# EAGLE schematic MM2_plates (EAGLE 7.4.0)
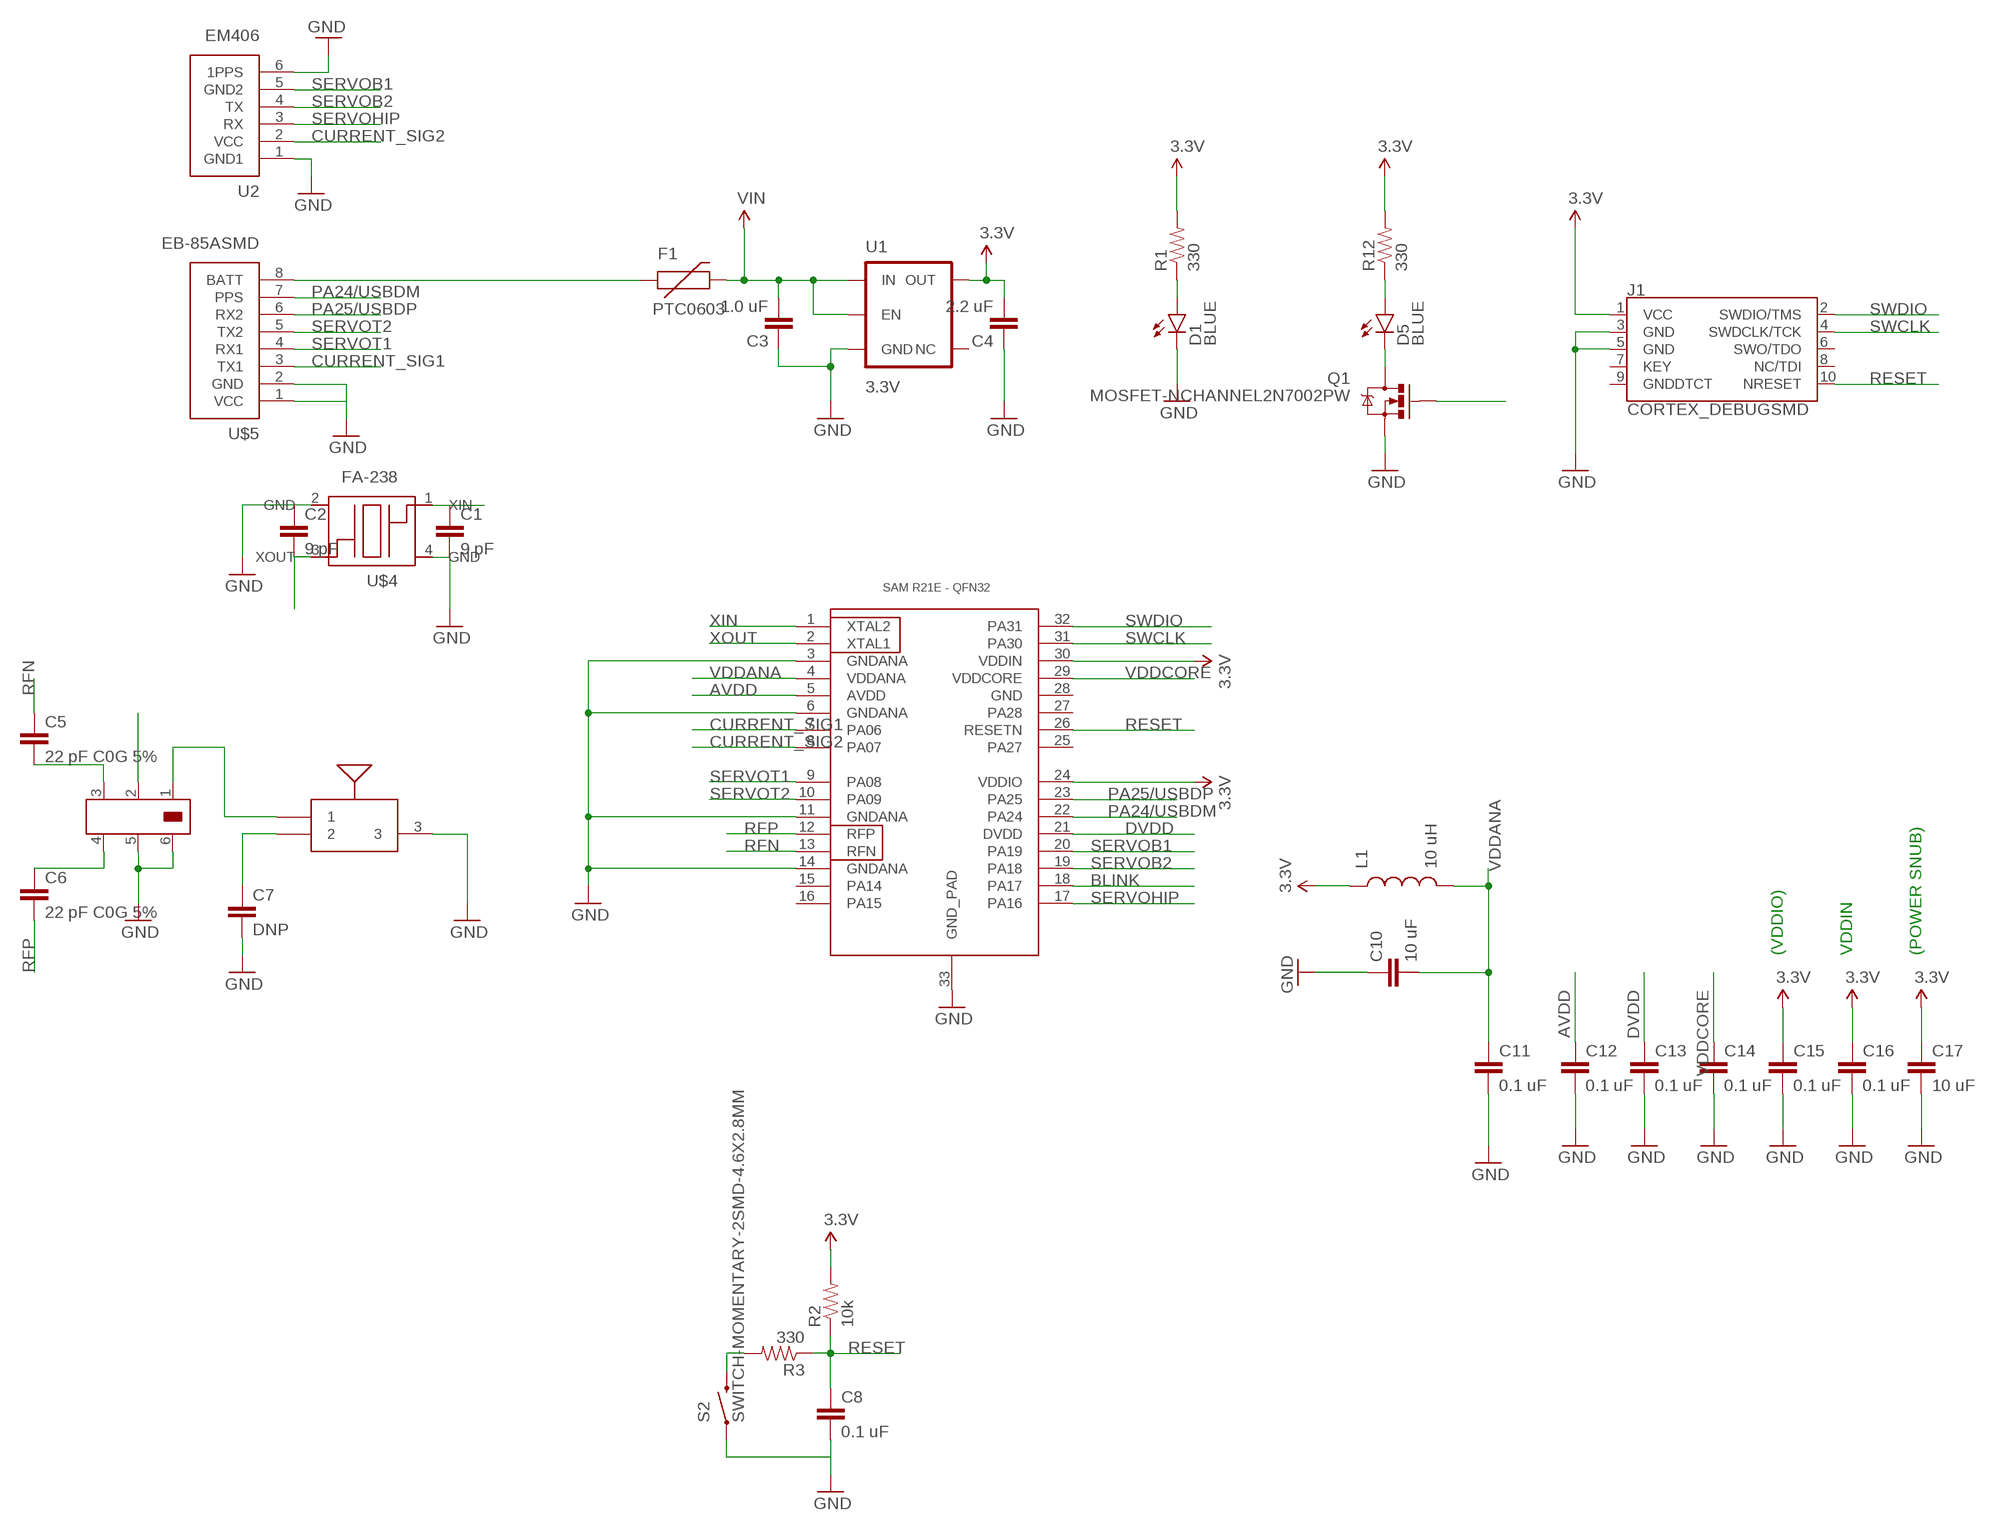
[diagram p0: schematic, sheet 1, part 1 of 2]
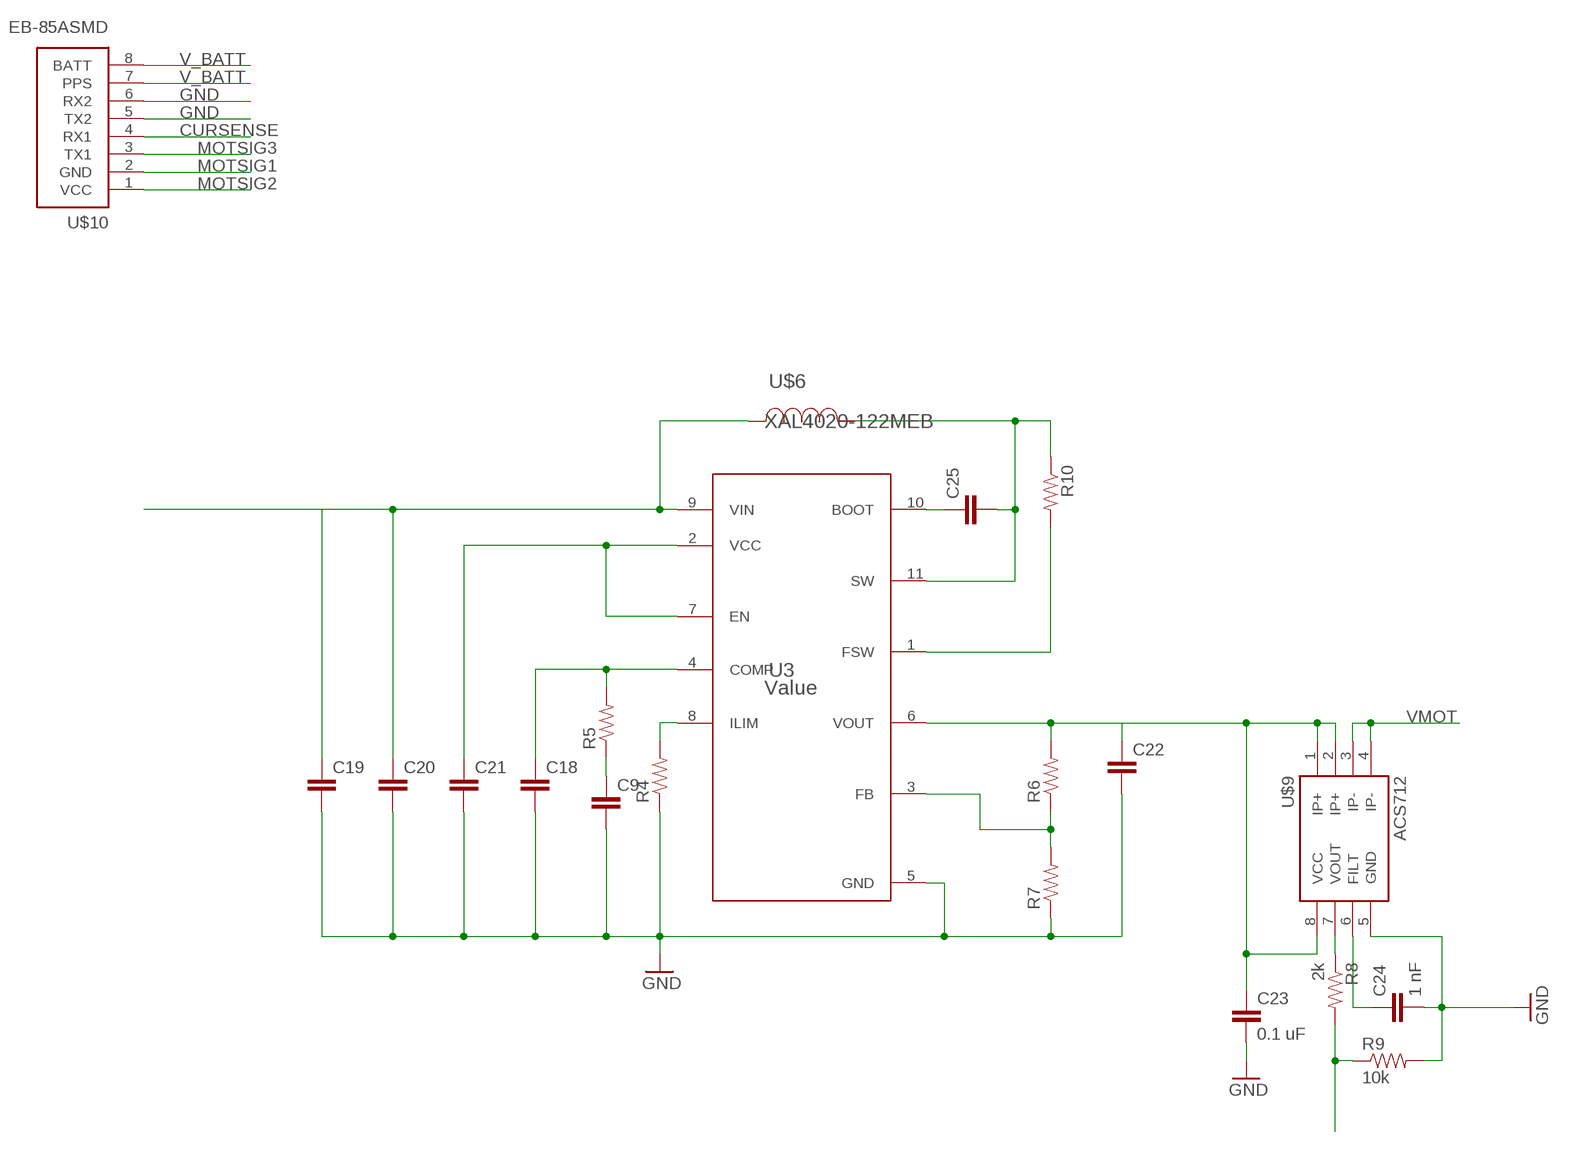
[diagram p1: schematic, sheet 1, part 2 of 2]

## Parts
C1  9 pF  CAP0402-CAP  [0402-CAP]
C2  9 pF  CAP0402-CAP  [0402-CAP]
C3  1.0 uF  CAP0402-CAP  [0402-CAP]
C4  2.2 uF  CAP0402-CAP  [0402-CAP]
C5  22 pF C0G 5%  CAP0402-CAP  [0402-CAP]
C6  22 pF C0G 5%  CAP0402-CAP  [0402-CAP]
C7  DNP  CAP0402-CAP  [0402-CAP]
C8  0.1 uF  CAP0402-CAP  [0402-CAP]
C9  CAP0805  [0805]
C10  10 uF  CAP0402-CAP  [0402-CAP]
C11  0.1 uF  CAP0402-CAP  [0402-CAP]
C12  0.1 uF  CAP0402-CAP  [0402-CAP]
C13  0.1 uF  CAP0402-CAP  [0402-CAP]
C14  0.1 uF  CAP0402-CAP  [0402-CAP]
C15  0.1 uF  CAP0402-CAP  [0402-CAP]
C16  0.1 uF  CAP0402-CAP  [0402-CAP]
C17  10 uF  CAP0402-CAP  [0402-CAP]
C18  CAP0805  [0805]
C19  CAP1206  [1206]
C20  CAP0402-CAP  [0402-CAP]
C21  CAP0603-CAP  [0603-CAP]
C22  CAP1206  [1206]
C23  0.1 uF  CAP0402-CAP  [0402-CAP]
C24  1 nF  CAP0402-CAP  [0402-CAP]
C25  CAP0402-CAP  [0402-CAP]
D1  BLUE  LED-BLUE0603  [LED-0603]
D5  BLUE  LED-BLUE0603  [LED-0603]
F1  PTC0603  [0603]
J1  CORTEX_DEBUGSMD  [SAMTECH_FTSH-105-01]
L1  10 uH  INDUCTOR0603  [0603]
Q1  MOSFET-NCHANNEL2N7002PW  [SOT323]
R1  330  RESISTOR0402-RES  [0402-RES]
R2  10k  RESISTOR0402-RES  [0402-RES]
R3  330  RESISTOR0402-RES  [0402-RES]
R4  RESISTOR1206  [1206]
R5  RESISTOR0402  [0402-RES]
R6  RESISTOR0402  [0402-RES]
R7  RESISTOR0603-RES  [0603-RES]
R8  2k  RESISTOR0402-RES  [0402-RES]
R9  10k  RESISTOR0402-RES  [0402-RES]
R10  RESISTOR1206  [1206]
R12  330  RESISTOR0402-RES  [0402-RES]
S2  SWITCH-MOMENTARY-2SMD-4.6X2.8MM  [TACTILE_SWITCH_SMD_4.6X2.8MM]
U1  3.3V  V_REG_AP2112K-3.3V  [SOT23-5]
U2  EM406  [EM406]
U3  Value  TPS61089RNRR  [RNR0011A]
U$1  ATSAMR21E18A-MUT  [QFN32]
U$2  JOHANSON_2450BM15A0015E  [0805_BALUN]
U$3  PULSE_ANT_2.4GHZ  [ANT_BAR]
U$4  FA-238  [FA-238]
U$5  EB-85ASMD  [EB-85A]
U$6  XAL4020-122MEB  [XAL4020]
U$9  ACS712  [SO08]
U$10  EB-85ASMD  [EB-85A]

## Nets
3.3V: C4.2 C15.1 C16.1 C17.1 J1.1(VCC) L1.1 R1.2 R2.2 R12.2 U1.5(OUT) U$1.24(VDDIO) U$1.30(VDDIN)
AVDD: C12.1 U$1.5(AVDD)
BLINK: Q1.1(G) U$1.18(PA17)
CURRENT_SIG1: U$1.7(PA06) U$5.3(TX1)
CURRENT_SIG2: U2.2(VCC) U$1.8(PA07)
CURSENSE: R8.2 R9.1 U$10.4(RX1)
DVDD: C13.1 U$1.21(DVDD)
GND: C1.2 C2.1 C3.1 C4.1 C7.2 C8.2 C9.2 C10.1 C11.2 C12.2 C13.2 C14.2 C15.2 C16.2 C17.2 C18.2 C19.2 C20.2 C21.2 C22.2 C23.2 C24.2 D1.C J1.3(GND) J1.5(GND) Q1.2(S) R4.1 R7.1 R9.2 S2.1 S2.2 U1.2(GND) U2.1(GND1) U2.6(1PPS) U3.5(GND) U$1.3(GNDANA) U$1.6(GNDANA) U$1.11(GNDANA) U$1.14(GNDANA) U$1.33(GND_PAD) U$2.5 U$2.6 U$3.3 U$4.2(GND) U$4.4(GND) U$5.1(VCC) U$5.2(GND) U$9.5(GND) U$10.5(TX2) U$10.6(RX2)
MOTSIG1: U$10.2(GND)
MOTSIG2: U$10.1(VCC)
MOTSIG3: U$10.3(TX1)
N$1: F1.1 U$5.8(BATT)
N$2: R3.2 S2.3 S2.4
N$3: R4.2 U3.8(ILIM)
N$6: U$2.1 U$3.1
N$7: C7.1 U$3.2
N$8: D1.A R1.1
N$10: C5.2 U$2.3
N$11: C6.1 U$2.4
N$12: U$2.2
N$14: C9.1 R5.1
N$15: C18.1 R5.2 U3.4(COMP)
N$16: C24.1 U$9.6(FILT)
N$17: R8.1 U$9.7(VOUT)
N$19: C21.1 U3.2(VCC) U3.7(EN)
N$20: D5.A R12.1
N$21: D5.C Q1.3(D)
N$27: C25.1 U3.10(BOOT)
N$28: C25.2 R10.1 U3.11(SW) U$6.2
N$29: R10.2 U3.1(FSW)
N$31: R6.1 R7.2 U3.3(FB)
PA24/USBDM: U$1.22(PA24) U$5.7(PPS)
PA25/USBDP: U$1.23(PA25) U$5.6(RX2)
RESET: C8.1 J1.10(NRESET) R2.1 R3.1 U$1.26(RESETN)
RFN: C5.1 U$1.13(RFN)
RFP: C6.2 U$1.12(RFP)
SERVOB1: U2.5(GND2) U$1.20(PA19)
SERVOB2: U2.4(TX) U$1.19(PA18)
SERVOHIP: U2.3(RX) U$1.17(PA16)
SERVOT1: U$1.9(PA08) U$5.4(RX1)
SERVOT2: U$1.10(PA09) U$5.5(TX2)
SWCLK: J1.4(SWDCLK/TCK) U$1.31(PA30)
SWDIO: J1.2(SWDIO/TMS) U$1.32(PA31)
V_BATT: C19.1 C20.1 U3.9(VIN) U$6.1 U$10.7(PPS) U$10.8(BATT)
V_MOT_UNSENSE: C22.1 C23.1 R6.2 U3.6(VOUT) U$9.1(IP+) U$9.2(IP+) U$9.8(VCC)
VDDANA: C10.2 C11.1 L1.2 U$1.4(VDDANA)
VDDCORE: C14.1 U$1.29(VDDCORE)
VIN: C3.2 F1.2 U1.1(IN) U1.3(EN)
VMOT: U$9.3(IP-) U$9.4(IP-)
XIN: C1.1 U$1.1(XTAL2) U$4.1(XIN)
XOUT: C2.2 U$1.2(XTAL1) U$4.3(XOUT)
Unconnected: J1.6(SWO/TDO) J1.7(KEY) J1.8(NC/TDI) J1.9(GNDDTCT) U1.4(NC) U$1.15(PA14) U$1.16(PA15) U$1.25(PA27) U$1.27(PA28) U$1.28(GND)

## Notes on the sheet
- (VDDIO) | VDDIN | (POWER SNUB)

## Library data of the parts
C1-C25 = SparkFun-Passives:CAP: Capacitor Standard 0603 ceramic capacitor, and 0.1" leaded capacitor.
D1 D5 = SparkFun-LED:LED-BLUE: Blue LEDs for production use Various blue LEDs stocked by SparkFun production 0603 - DIO-08575 Rebel - DIO-09553 1206 - DIO-09911; PROD_ID: DIO-08575
F1 = SparkFun-PowerIC:PTC: Resettable Fuse PTC Resettable Fuse. Spark Fun Electronics SKU : COM-08357
J1 = SparkFun-Connectors:CORTEX_DEBUG: Cortex Debug Connector Datasheet <http://infocenter.arm.com/help/topic/com.arm.doc.faqs/attached/13634/cortex_debug_connectors.pdf>
L1 = SparkFun-Passives:INDUCTOR: Inductors Basic Inductor/Choke - 0603 and 1206. Footprints are not proven and vary greatly between part numbers. INDUCTOR POWER 3.3UH 4.0A SMD 0.197" L x 0.197" W x 0.177" H (5.00mm x 5.00mm x 4.50mm)
Q1 = SparkFun-DiscreteSemi:MOSFET-NCHANNEL: Common NMOSFET Parts MFG P/N Store ID Prod ID FDD8780 TRANS-09984 SI7820DN TRANS-11055 FDS6630A IC-08089 2N7002PW TRANS-11151 FQP30N06L COM-10213 TRANS-10060 BSS123LT1G TRANS-08345 BSS138 TRANS-00830 BS170 2N7000; PROD_ID: TRANS-11151
R1-R3 R7-R9 R12 = SparkFun-Passives:RESISTOR: Resistor Basic schematic elements and footprints for 0603, 1206, and PTH resistors.
R4-R6 R10 = SparkFun-Resistors:RESISTOR: Resistor Basic schematic elements and footprints for 0603, 1206, and PTH resistors.
S2 = SparkFun-Electromechanical:SWITCH-MOMENTARY-2: Various NO switches- pushbuttons, reed, etc; PROD_ID: SWCH-13065
U1 = SparkFun-PowerIC:V_REG_AP2112: AP2112 - 600mA CMOS LDO Regulator w/ Enable The AP2112 is CMOS process low dropout linear regulator with enable function, the regulator delivers a guaranteed 600mA (min.) continuous load current. Features Output Voltage Accuracy: ±1.5% Output Current: 600mA (Min.) Foldback Short Current Protection: 50mA Enable Function to Turn ON/OFF VOUT Low Dropout Voltage (3.3V): 250mV (Typ.) @IOUT=600mA Excellent Load Regulation: 0.2%/A (Typ.) Excellent Line Regulation: 0.02%/V (Typ.) Low Quiescent Current: 55μA (Typ.) Low Standby Current: 0.01μA (Typ.) Low Output Noise: 50μVRMS PSRR: 100Hz -65dB, 1kHz -65dB OTSD Protection Stable with 1.0μF Flexible Cap: Ceramic, Tantalum and Aluminum Electrolytic Operation Temperature Range: -40°C to 85°C ESD: MM 400V, HBM 4000V; PROD_ID: VREG-12457
U2 = SparkFun-Connectors:EM406: EM406 GPS Connector Proven layout and schematic for EM406 connector. Spark Fun Electronics SKU : GPS-00579
U3 = TPS61089RNRR_4.8V:TPS61089RNRR; MANUFACTURER: Texas Instruments; MANUFACTURER_NAME: Texas Instruments; MANUFACTURER_PART_NUMBER: TPS61089RNRR; PARTNUMBER: TPS61089RNRR; REFDES: RefDes; TYPE: TYPE
U$1 = atmel-samr21:ATSAMR21E18A-MUT: This is the ATMEL SAMR21E QFN-32. ATSAMR21E18A
U$2 = balun:JOHANSON_2450BM15A0015E
U$3 = bar_antenna:PULSE_ANT_2.4GHZ: Manufacturer part #W3008
U$4 = crystals:FA-238
U$5 U$10 = SparkFun-Connectors:EB-85A: EB-85A Connector Proven layout and schematic for ETek 5Hz GPS receiver connector. Spark Fun Electronics SKU : GPS-08297
U$6 = TPS61089RNRR_4.8V:XAL4020-122MEB
U$9 = SparkFun-AnalogIC:ACS712: Hall-effect-based isolated linear current sensor; PROD_ID: IC-08964